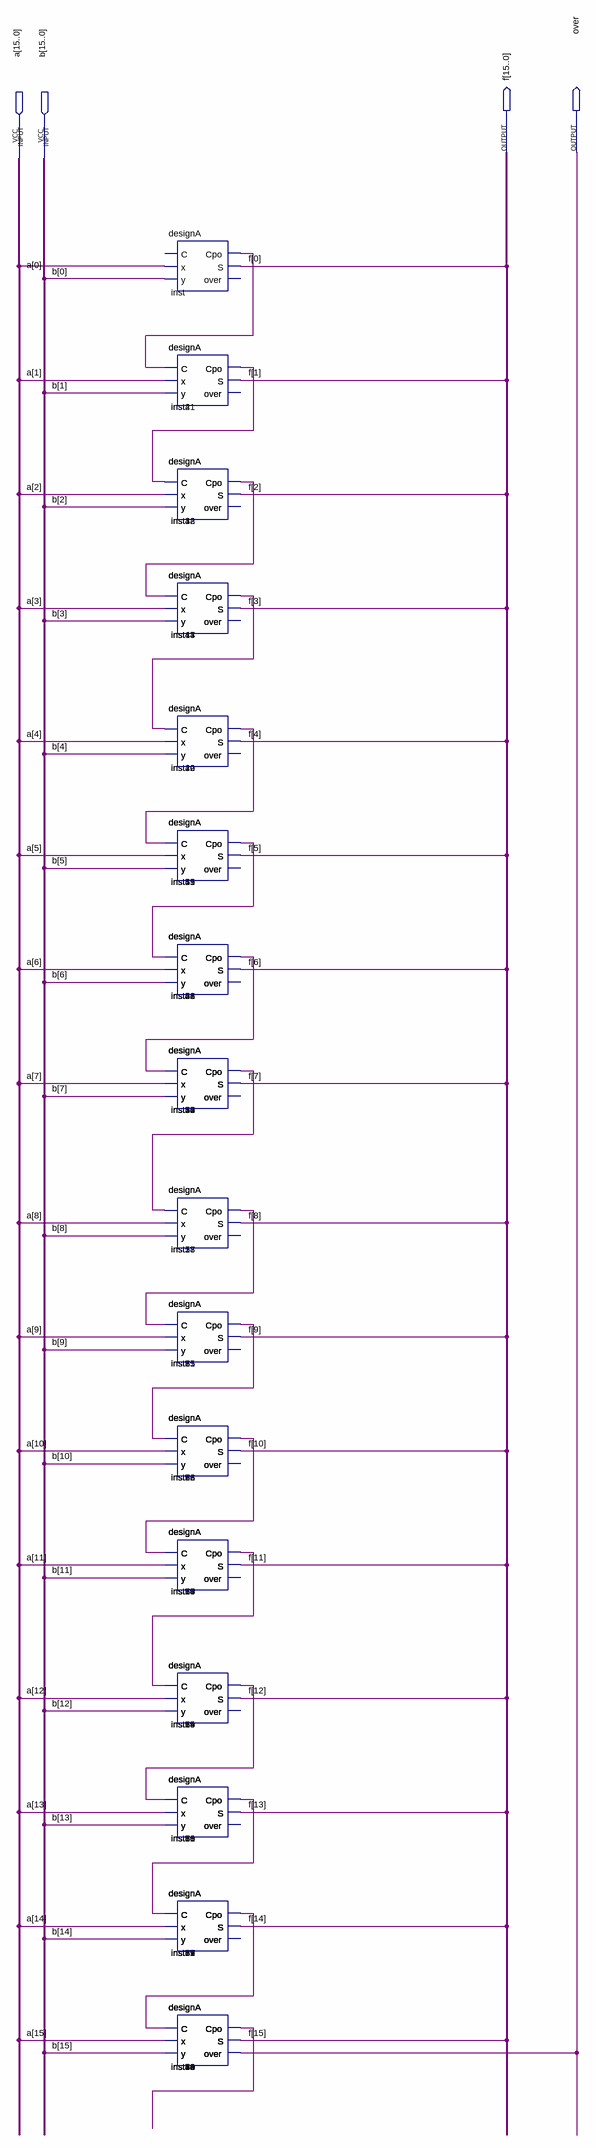
[diagram p0: schematic sheet]
// Quartus schematic addition_unit.bdf as structural Verilog: 84 symbols, 4 pins
module addition_unit (
  input  [15:0] a,
  input  [15:0] b,
  output [15:0] f,
  output over
);

  wire inst2_cpo, inst2_over, inst3_cpo, inst3_over, inst4_cpo, inst4_over, inst5_cpo, inst5_over, inst6_cpo,
       inst6_over, inst7_cpo, inst7_over, inst8_cpo, inst8_over, inst9_cpo, inst9_over, inst10_cpo,
       inst10_over, inst11_cpo, inst11_over, inst12_cpo, inst12_over, inst13_cpo, inst13_over, inst14_cpo,
       inst14_over, inst15_cpo, inst15_over, inst16_cpo, inst_cpo;

  designA inst (.x(a[0]), .y(b[0]), .Cpo(inst_cpo), .S(f[0]));  // open: C, over
  designA inst2 (.C(inst_cpo), .x(a[1]), .y(b[1]), .Cpo(inst2_cpo), .S(f[1]), .over(inst2_over));
  designA inst41 (.C(inst_cpo), .x(a[1]), .y(b[1]), .Cpo(inst2_cpo), .S(f[1]), .over(inst2_over));
  designA inst3 (.C(inst2_cpo), .x(a[2]), .y(b[2]), .Cpo(inst3_cpo), .S(f[2]), .over(inst3_over));
  designA inst18 (.C(inst2_cpo), .x(a[2]), .y(b[2]), .Cpo(inst3_cpo), .S(f[2]), .over(inst3_over));
  designA inst42 (.C(inst2_cpo), .x(a[2]), .y(b[2]), .Cpo(inst3_cpo), .S(f[2]), .over(inst3_over));
  designA inst4 (.C(inst3_cpo), .x(a[3]), .y(b[3]), .Cpo(inst4_cpo), .S(f[3]), .over(inst4_over));
  designA inst17 (.C(inst3_cpo), .x(a[3]), .y(b[3]), .Cpo(inst4_cpo), .S(f[3]), .over(inst4_over));
  designA inst43 (.C(inst3_cpo), .x(a[3]), .y(b[3]), .Cpo(inst4_cpo), .S(f[3]), .over(inst4_over));
  designA inst44 (.C(inst3_cpo), .x(a[3]), .y(b[3]), .Cpo(inst4_cpo), .S(f[3]), .over(inst4_over));
  designA inst12 (.C(inst4_cpo), .x(a[4]), .y(b[4]), .Cpo(inst12_cpo), .S(f[4]), .over(inst12_over));
  designA inst20 (.C(inst4_cpo), .x(a[4]), .y(b[4]), .Cpo(inst12_cpo), .S(f[4]), .over(inst12_over));
  designA inst49 (.C(inst4_cpo), .x(a[4]), .y(b[4]), .Cpo(inst12_cpo), .S(f[4]), .over(inst12_over));
  designA inst5 (.C(inst12_cpo), .x(a[5]), .y(b[5]), .Cpo(inst5_cpo), .S(f[5]), .over(inst5_over));
  designA inst19 (.C(inst12_cpo), .x(a[5]), .y(b[5]), .Cpo(inst5_cpo), .S(f[5]), .over(inst5_over));
  designA inst45 (.C(inst12_cpo), .x(a[5]), .y(b[5]), .Cpo(inst5_cpo), .S(f[5]), .over(inst5_over));
  designA inst51 (.C(inst12_cpo), .x(a[5]), .y(b[5]), .Cpo(inst5_cpo), .S(f[5]), .over(inst5_over));
  designA inst6 (.C(inst5_cpo), .x(a[6]), .y(b[6]), .Cpo(inst6_cpo), .S(f[6]), .over(inst6_over));
  designA inst21 (.C(inst5_cpo), .x(a[6]), .y(b[6]), .Cpo(inst6_cpo), .S(f[6]), .over(inst6_over));
  designA inst23 (.C(inst5_cpo), .x(a[6]), .y(b[6]), .Cpo(inst6_cpo), .S(f[6]), .over(inst6_over));
  designA inst46 (.C(inst5_cpo), .x(a[6]), .y(b[6]), .Cpo(inst6_cpo), .S(f[6]), .over(inst6_over));
  designA inst48 (.C(inst5_cpo), .x(a[6]), .y(b[6]), .Cpo(inst6_cpo), .S(f[6]), .over(inst6_over));
  designA inst52 (.C(inst5_cpo), .x(a[6]), .y(b[6]), .Cpo(inst6_cpo), .S(f[6]), .over(inst6_over));
  designA inst7 (.C(inst6_cpo), .x(a[7]), .y(b[7]), .Cpo(inst7_cpo), .S(f[7]), .over(inst7_over));
  designA inst22 (.C(inst6_cpo), .x(a[7]), .y(b[7]), .Cpo(inst7_cpo), .S(f[7]), .over(inst7_over));
  designA inst24 (.C(inst6_cpo), .x(a[7]), .y(b[7]), .Cpo(inst7_cpo), .S(f[7]), .over(inst7_over));
  designA inst47 (.C(inst6_cpo), .x(a[7]), .y(b[7]), .Cpo(inst7_cpo), .S(f[7]), .over(inst7_over));
  designA inst50 (.C(inst6_cpo), .x(a[7]), .y(b[7]), .Cpo(inst7_cpo), .S(f[7]), .over(inst7_over));
  designA inst53 (.C(inst6_cpo), .x(a[7]), .y(b[7]), .Cpo(inst7_cpo), .S(f[7]), .over(inst7_over));
  designA inst54 (.C(inst6_cpo), .x(a[7]), .y(b[7]), .Cpo(inst7_cpo), .S(f[7]), .over(inst7_over));
  designA inst13 (.C(inst7_cpo), .x(a[8]), .y(b[8]), .Cpo(inst13_cpo), .S(f[8]), .over(inst13_over));
  designA inst27 (.C(inst7_cpo), .x(a[8]), .y(b[8]), .Cpo(inst13_cpo), .S(f[8]), .over(inst13_over));
  designA inst58 (.C(inst7_cpo), .x(a[8]), .y(b[8]), .Cpo(inst13_cpo), .S(f[8]), .over(inst13_over));
  designA inst8 (.C(inst13_cpo), .x(a[9]), .y(b[9]), .Cpo(inst8_cpo), .S(f[9]), .over(inst8_over));
  designA inst25 (.C(inst13_cpo), .x(a[9]), .y(b[9]), .Cpo(inst8_cpo), .S(f[9]), .over(inst8_over));
  designA inst55 (.C(inst13_cpo), .x(a[9]), .y(b[9]), .Cpo(inst8_cpo), .S(f[9]), .over(inst8_over));
  designA inst71 (.C(inst13_cpo), .x(a[9]), .y(b[9]), .Cpo(inst8_cpo), .S(f[9]), .over(inst8_over));
  designA inst9 (.C(inst8_cpo), .x(a[10]), .y(b[10]), .Cpo(inst9_cpo), .S(f[10]), .over(inst9_over));
  designA inst26 (.C(inst8_cpo), .x(a[10]), .y(b[10]), .Cpo(inst9_cpo), .S(f[10]), .over(inst9_over));
  designA inst33 (.C(inst8_cpo), .x(a[10]), .y(b[10]), .Cpo(inst9_cpo), .S(f[10]), .over(inst9_over));
  designA inst56 (.C(inst8_cpo), .x(a[10]), .y(b[10]), .Cpo(inst9_cpo), .S(f[10]), .over(inst9_over));
  designA inst63 (.C(inst8_cpo), .x(a[10]), .y(b[10]), .Cpo(inst9_cpo), .S(f[10]), .over(inst9_over));
  designA inst72 (.C(inst8_cpo), .x(a[10]), .y(b[10]), .Cpo(inst9_cpo), .S(f[10]), .over(inst9_over));
  designA inst10 (.C(inst9_cpo), .x(a[11]), .y(b[11]), .Cpo(inst10_cpo), .S(f[11]), .over(inst10_over));
  designA inst28 (.C(inst9_cpo), .x(a[11]), .y(b[11]), .Cpo(inst10_cpo), .S(f[11]), .over(inst10_over));
  designA inst34 (.C(inst9_cpo), .x(a[11]), .y(b[11]), .Cpo(inst10_cpo), .S(f[11]), .over(inst10_over));
  designA inst57 (.C(inst9_cpo), .x(a[11]), .y(b[11]), .Cpo(inst10_cpo), .S(f[11]), .over(inst10_over));
  designA inst64 (.C(inst9_cpo), .x(a[11]), .y(b[11]), .Cpo(inst10_cpo), .S(f[11]), .over(inst10_over));
  designA inst73 (.C(inst9_cpo), .x(a[11]), .y(b[11]), .Cpo(inst10_cpo), .S(f[11]), .over(inst10_over));
  designA inst74 (.C(inst9_cpo), .x(a[11]), .y(b[11]), .Cpo(inst10_cpo), .S(f[11]), .over(inst10_over));
  designA inst14 (.C(inst10_cpo), .x(a[12]), .y(b[12]), .Cpo(inst14_cpo), .S(f[12]), .over(inst14_over));
  designA inst29 (.C(inst10_cpo), .x(a[12]), .y(b[12]), .Cpo(inst14_cpo), .S(f[12]), .over(inst14_over));
  designA inst35 (.C(inst10_cpo), .x(a[12]), .y(b[12]), .Cpo(inst14_cpo), .S(f[12]), .over(inst14_over));
  designA inst59 (.C(inst10_cpo), .x(a[12]), .y(b[12]), .Cpo(inst14_cpo), .S(f[12]), .over(inst14_over));
  designA inst65 (.C(inst10_cpo), .x(a[12]), .y(b[12]), .Cpo(inst14_cpo), .S(f[12]), .over(inst14_over));
  designA inst75 (.C(inst10_cpo), .x(a[12]), .y(b[12]), .Cpo(inst14_cpo), .S(f[12]), .over(inst14_over));
  designA inst11 (.C(inst14_cpo), .x(a[13]), .y(b[13]), .Cpo(inst11_cpo), .S(f[13]), .over(inst11_over));
  designA inst30 (.C(inst14_cpo), .x(a[13]), .y(b[13]), .Cpo(inst11_cpo), .S(f[13]), .over(inst11_over));
  designA inst36 (.C(inst14_cpo), .x(a[13]), .y(b[13]), .Cpo(inst11_cpo), .S(f[13]), .over(inst11_over));
  designA inst60 (.C(inst14_cpo), .x(a[13]), .y(b[13]), .Cpo(inst11_cpo), .S(f[13]), .over(inst11_over));
  designA inst66 (.C(inst14_cpo), .x(a[13]), .y(b[13]), .Cpo(inst11_cpo), .S(f[13]), .over(inst11_over));
  designA inst76 (.C(inst14_cpo), .x(a[13]), .y(b[13]), .Cpo(inst11_cpo), .S(f[13]), .over(inst11_over));
  designA inst81 (.C(inst14_cpo), .x(a[13]), .y(b[13]), .Cpo(inst11_cpo), .S(f[13]), .over(inst11_over));
  designA inst15 (.C(inst11_cpo), .x(a[14]), .y(b[14]), .Cpo(inst15_cpo), .S(f[14]), .over(inst15_over));
  designA inst31 (.C(inst11_cpo), .x(a[14]), .y(b[14]), .Cpo(inst15_cpo), .S(f[14]), .over(inst15_over));
  designA inst37 (.C(inst11_cpo), .x(a[14]), .y(b[14]), .Cpo(inst15_cpo), .S(f[14]), .over(inst15_over));
  designA inst39 (.C(inst11_cpo), .x(a[14]), .y(b[14]), .Cpo(inst15_cpo), .S(f[14]), .over(inst15_over));
  designA inst61 (.C(inst11_cpo), .x(a[14]), .y(b[14]), .Cpo(inst15_cpo), .S(f[14]), .over(inst15_over));
  designA inst67 (.C(inst11_cpo), .x(a[14]), .y(b[14]), .Cpo(inst15_cpo), .S(f[14]), .over(inst15_over));
  designA inst69 (.C(inst11_cpo), .x(a[14]), .y(b[14]), .Cpo(inst15_cpo), .S(f[14]), .over(inst15_over));
  designA inst77 (.C(inst11_cpo), .x(a[14]), .y(b[14]), .Cpo(inst15_cpo), .S(f[14]), .over(inst15_over));
  designA inst79 (.C(inst11_cpo), .x(a[14]), .y(b[14]), .Cpo(inst15_cpo), .S(f[14]), .over(inst15_over));
  designA inst82 (.C(inst11_cpo), .x(a[14]), .y(b[14]), .Cpo(inst15_cpo), .S(f[14]), .over(inst15_over));
  designA inst16 (.C(inst15_cpo), .x(a[15]), .y(b[15]), .Cpo(inst16_cpo), .S(f[15]), .over(over));
  designA inst32 (.C(inst15_cpo), .x(a[15]), .y(b[15]), .Cpo(inst16_cpo), .S(f[15]), .over(over));
  designA inst38 (.C(inst15_cpo), .x(a[15]), .y(b[15]), .Cpo(inst16_cpo), .S(f[15]), .over(over));
  designA inst40 (.C(inst15_cpo), .x(a[15]), .y(b[15]), .Cpo(inst16_cpo), .S(f[15]), .over(over));
  designA inst62 (.C(inst15_cpo), .x(a[15]), .y(b[15]), .Cpo(inst16_cpo), .S(f[15]), .over(over));
  designA inst68 (.C(inst15_cpo), .x(a[15]), .y(b[15]), .Cpo(inst16_cpo), .S(f[15]), .over(over));
  designA inst70 (.C(inst15_cpo), .x(a[15]), .y(b[15]), .Cpo(inst16_cpo), .S(f[15]), .over(over));
  designA inst78 (.C(inst15_cpo), .x(a[15]), .y(b[15]), .Cpo(inst16_cpo), .S(f[15]), .over(over));
  designA inst80 (.C(inst15_cpo), .x(a[15]), .y(b[15]), .Cpo(inst16_cpo), .S(f[15]), .over(over));
  designA inst83 (.C(inst15_cpo), .x(a[15]), .y(b[15]), .Cpo(inst16_cpo), .S(f[15]), .over(over));
  designA inst84 (.C(inst15_cpo), .x(a[15]), .y(b[15]), .Cpo(inst16_cpo), .S(f[15]), .over(over));
endmodule
